# Altium schematic sheet Buttons.SchDoc
size A; SheetNumber: 4; SheetTotal: 7
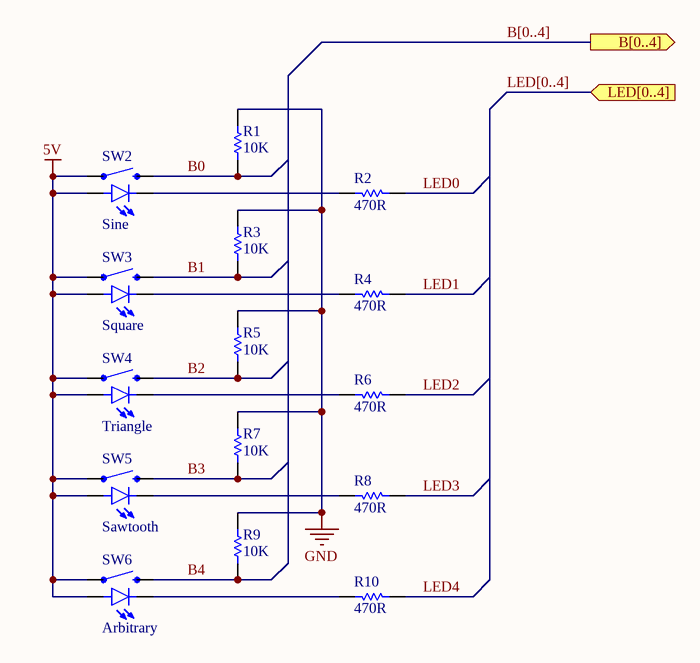
[diagram p0: Buttons.SchDoc]

## Parts
R1  10K  [RESISTOR]
R2  470R  [RESISTOR]
R3  10K  [RESISTOR]
R4  470R  [RESISTOR]
R5  10K  [RESISTOR]
R6  470R  [RESISTOR]
R7  10K  [RESISTOR]
R8  470R  [RESISTOR]
R9  10K  [RESISTOR]
R10  470R  [RESISTOR]
SW2  Sine  [TACTILE-PTH-LED]
SW3  Square  [TACTILE-PTH-LED]
SW4  Triangle  [TACTILE-PTH-LED]
SW5  Sawtooth  [TACTILE-PTH-LED]
SW6  Arbitrary  [TACTILE-PTH-LED]

## Ports
B[0..4] (out), LED[0..4] (in)

## Nets
5V: SW2.4 SW2.A SW3.4 SW3.A SW4.4 SW4.A SW5.4 SW5.A SW6.4 SW6.A
GND: R1.1 R3.1 R5.1 R7.1 R9.1
B0: R1.2 SW2.2
B1: R3.2 SW3.2
B2: R5.2 SW4.2
B3: R7.2 SW5.2
B4: R9.2 SW6.2
LED0: R2.1
LED1: R4.1
LED2: R6.1
LED3: R8.1
LED4: R10.1
NetR2_2: R2.2 SW2.C
NetR4_2: R4.2 SW3.C
NetR6_2: R6.2 SW4.C
NetR8_2: R8.2 SW5.C
NetR10_2: R10.2 SW6.C

## Buses and harness runs
bus B[0..4] = port B[0..4]
bus LED[0..4] = port LED[0..4]

## Library data of the parts
R1-R10 = Resistor
SW2-SW6 = SwitchLED